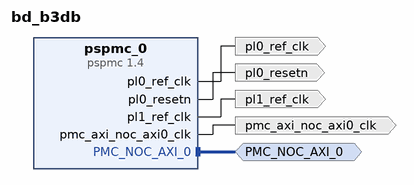
[diagram p0: block diagram of the top level]
# Vivado block design bd_b3db, xcvc1902-vsva2197-2MP-e-S, Vivado 2023.2
create_bd_design bd_b3db

create_bd_intf_port -mode Master -vlnv xilinx.com:interface:aximm_rtl:1.0 PMC_NOC_AXI_0
set_property -dict {CONFIG.FREQ_HZ 400000000 CONFIG.INDEX 0 CONFIG.SLR_INDEX 0} [get_bd_intf_ports PMC_NOC_AXI_0]
create_bd_port -dir O -type clk pl0_ref_clk
set_property -dict {CONFIG.FREQ_HZ 79999199} [get_bd_ports pl0_ref_clk]
create_bd_port -dir O -type clk pl1_ref_clk
set_property -dict {CONFIG.FREQ_HZ 333329987} [get_bd_ports pl1_ref_clk]
create_bd_port -dir O -type rst pl0_resetn
create_bd_port -dir O -type clk pmc_axi_noc_axi0_clk
set_property -dict {CONFIG.FREQ_HZ 400000000} [get_bd_ports pmc_axi_noc_axi0_clk]

create_bd_cell -type ip -vlnv xilinx.com:ip:pspmc:1.4 pspmc_0
